# Altium schematic sheet Converter_PWM to Voltage.SchDoc
size 81 x 30 mm
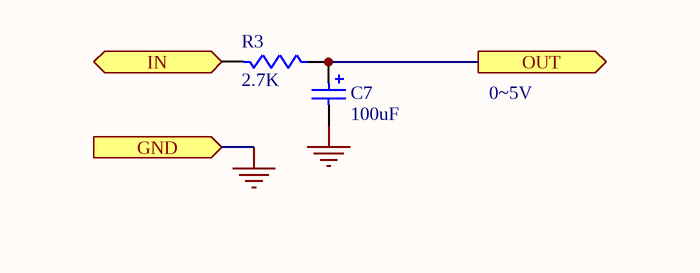
[diagram p0: Converter_PWM to Voltage.SchDoc]

## Parts
C7  value 100uF  [CAPPR2.5-6.3x5]  (hidden comment: Capacitor)
R3  value 2.7K  [AXIAL-0.4]  (hidden comment: Resistor)

## Ports
GND (in), IN (in), OUT (out)

## Nets
GND: C7.2 ; port GND
IN: R3.2 ; port IN
OUT: C7.1 R3.1 ; port OUT

## Notes on the sheet
- 0~5V

## Library data of the parts
C7 = Cap Pol1: Polarized Capacitor (Radial); Manufacturer: Generic Components; Class I: Passive; Published: 8-Jun-2000; Revision: July-2002: Re-released for DXP Platform.; Publisher: Altium Limited; Class II: Capacitor
R3 = Res1: Manufacturer: Generic Components; Class I: Passive; Published: 8-Jun-2000; Revision: July-2002: Re-released for DXP Platform.; Publisher: Altium Limited; Class II: Resistor